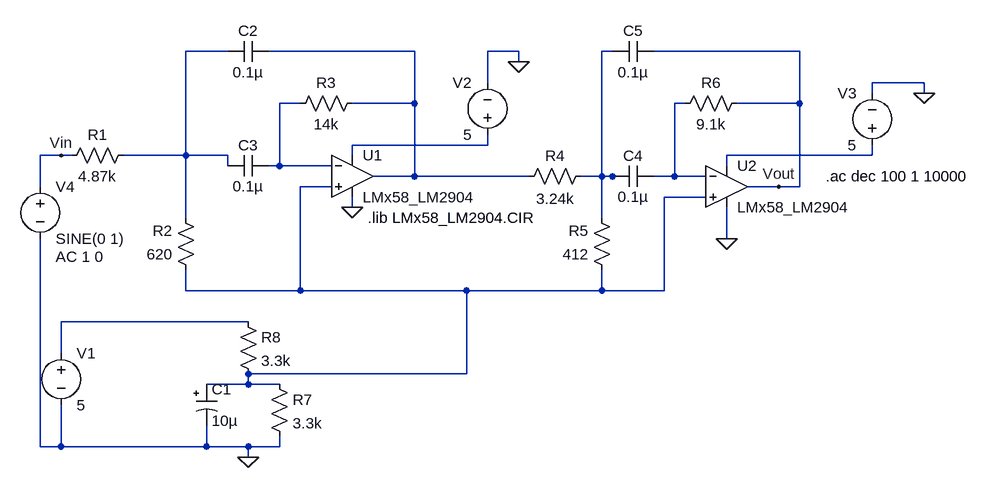
[diagram p0: schematic bandpass_Carl.asc]
bandpass_Carl.asc, the LTspice schematic file:
Version 4
SHEET 1 1232 680
WIRE 0 32 -64 32
WIRE 288 32 64 32
WIRE 448 32 400 32
WIRE 592 32 576 32
WIRE 880 32 656 32
WIRE 448 48 448 32
WIRE 400 80 400 32
WIRE 1072 80 992 80
WIRE 992 96 992 80
WIRE 1072 96 1072 80
WIRE 112 112 80 112
WIRE 288 112 288 32
WIRE 288 112 192 112
WIRE 704 112 688 112
WIRE 880 112 880 32
WIRE 880 112 784 112
WIRE 400 176 400 160
WIRE 400 176 192 176
WIRE -256 192 -288 192
WIRE -240 192 -256 192
WIRE -64 192 -64 32
WIRE -64 192 -160 192
WIRE 0 192 -64 192
WIRE 192 192 192 176
WIRE 992 192 992 176
WIRE 992 192 768 192
WIRE 0 208 0 192
WIRE 80 208 80 112
WIRE 80 208 64 208
WIRE 160 208 80 208
WIRE 768 208 768 192
WIRE 288 224 288 112
WIRE 288 224 224 224
WIRE 464 224 288 224
WIRE 576 224 576 32
WIRE 576 224 544 224
WIRE 592 224 576 224
WIRE 608 224 592 224
WIRE 688 224 688 112
WIRE 688 224 656 224
WIRE 736 224 688 224
WIRE -288 240 -288 192
WIRE 160 240 112 240
WIRE 848 240 800 240
WIRE 880 240 880 112
WIRE 880 240 848 240
WIRE 736 256 672 256
WIRE 192 272 192 256
WIRE -64 288 -64 192
WIRE 576 288 576 224
WIRE 768 320 768 272
WIRE -64 400 -64 368
WIRE 112 400 112 240
WIRE 112 400 -64 400
WIRE 368 400 112 400
WIRE 576 400 576 368
WIRE 576 400 368 400
WIRE 672 400 672 256
WIRE 672 400 576 400
WIRE 32 448 -256 448
WIRE -256 496 -256 448
WIRE 368 528 368 400
WIRE 368 528 32 528
WIRE 32 544 32 528
WIRE 32 544 -32 544
WIRE 80 544 32 544
WIRE -288 640 -288 320
WIRE -256 640 -256 576
WIRE -256 640 -288 640
WIRE -32 640 -32 608
WIRE -32 640 -256 640
WIRE 32 640 -32 640
WIRE 80 640 80 624
WIRE 80 640 32 640
WIRE 32 656 32 640
FLAG 32 656 0
FLAG 192 272 0
FLAG 768 320 0
FLAG 448 48 0
FLAG 1072 96 0
FLAG -256 192 Vin
FLAG 848 240 Vout
SYMBOL res -144 176 R90
WINDOW 0 0 56 VBottom 2
WINDOW 3 32 56 VTop 2
SYMATTR InstName R1
SYMATTR Value 4.87k
SYMBOL res -48 384 R180
WINDOW 0 36 76 Left 2
WINDOW 3 36 40 Left 2
SYMATTR InstName R2
SYMATTR Value 620
SYMBOL res 208 96 R90
WINDOW 0 0 56 VBottom 2
WINDOW 3 32 56 VTop 2
SYMATTR InstName R3
SYMATTR Value 14k
SYMBOL res 560 208 R90
WINDOW 0 0 56 VBottom 2
WINDOW 3 35 55 VTop 2
SYMATTR InstName R4
SYMATTR Value 3.24k
SYMBOL res 592 384 R180
WINDOW 0 36 76 Left 2
WINDOW 3 36 40 Left 2
SYMATTR InstName R5
SYMATTR Value 412
SYMBOL res 800 96 R90
WINDOW 0 0 56 VBottom 2
WINDOW 3 32 56 VTop 2
SYMATTR InstName R6
SYMATTR Value 9.1k
SYMBOL polcap -48 544 R0
SYMATTR InstName C1
SYMATTR Value 10µ
SYMATTR Description Capacitor
SYMATTR Type cap
SYMATTR SpiceLine Rser=4 Lser=0 mfg="AVX" pn="TAJA106M006" type="Tantalum"
SYMBOL cap 64 16 R90
WINDOW 0 0 32 VBottom 2
WINDOW 3 32 32 VTop 2
SYMATTR InstName C2
SYMATTR Value 0.1µ
SYMBOL cap 64 192 R90
WINDOW 0 0 32 VBottom 2
WINDOW 3 32 32 VTop 2
SYMATTR InstName C3
SYMATTR Value 0.1µ
SYMBOL cap 656 208 R90
WINDOW 0 0 32 VBottom 2
WINDOW 3 32 32 VTop 2
SYMATTR InstName C4
SYMATTR Value 0.1µ
SYMBOL res 64 528 R0
SYMATTR InstName R7
SYMATTR Value 3.3k
SYMBOL res 16 432 R0
SYMATTR InstName R8
SYMATTR Value 3.3k
SYMBOL cap 656 16 R90
WINDOW 0 0 32 VBottom 2
WINDOW 3 32 32 VTop 2
SYMATTR InstName C5
SYMATTR Value 0.1µ
SYMBOL Opamps/opamp2 192 160 R0
SYMATTR InstName U1
SYMATTR Value LMx58_LM2904
SYMBOL Opamps/opamp2 768 176 R0
SYMATTR InstName U2
SYMATTR Value LMx58_LM2904
SYMBOL voltage -256 480 R0
SYMATTR InstName V1
SYMATTR Value 5
SYMBOL voltage 400 176 R180
WINDOW 0 24 96 Left 2
WINDOW 3 24 16 Left 2
SYMATTR InstName V2
SYMATTR Value 5
SYMBOL voltage 992 192 R180
WINDOW 0 24 96 Left 2
WINDOW 3 24 16 Left 2
SYMATTR InstName V3
SYMATTR Value 5
SYMBOL voltage -288 224 R0
WINDOW 123 24 124 Left 2
WINDOW 39 0 0 Left 0
SYMATTR InstName V4
SYMATTR Value SINE(0 1)
SYMATTR Value2 AC 1 0
TEXT 216 288 Left 2 !.lib LMx58_LM2904.CIR
TEXT 920 224 Left 2 !.ac dec 100 1 10000

The netlist it stands for:
* bandpass_Carl.asc
R1 N001 Vin 4.87k
R2 N008 N001 620
R3 N002 N004 14k
R4 N003 N002 3.24k
R5 N008 N003 412
R6 Vout N005 9.1k
C1 N008 0 10µ Rser=4 Lser=0 mfg="AVX" pn="TAJA106M006" type="Tantalum"
C2 N002 N001 0.1µ
C3 N004 N001 0.1µ
C4 N005 N003 0.1µ
R7 N008 0 3.3k
R8 N009 N008 3.3k
C5 Vout N003 0.1µ
XU1 N008 N004 N006 0 N002 LMx58_LM2904  ; pins In+ In- V+ V- OUT
XU2 N008 N005 N007 0 Vout LMx58_LM2904  ; pins In+ In- V+ V- OUT
V1 N009 0 5
V2 N006 0 5
V3 N007 0 5
V4 Vin 0 SINE(0 1) AC 1 0
.lib LMx58_LM2904.CIR
.ac dec 100 1 10000
.backanno
.end